# Altium project SolarPanelZPlus.PrjPcb
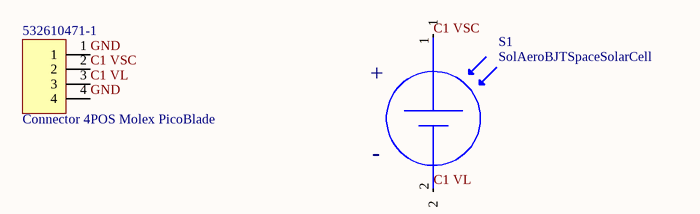
[diagram p0: SolarPanelZPlus.SchDoc]
1 sheet, 2 parts. Net scope: global (net labels, ports and power ports of the same name join across sheets).
Board file: SolarpanelZPlus.PcbDoc

## Sheet SolarPanelZPlus.SchDoc
size A

### Parts
532610471-1  Connector 4POS Molex PicoBlade  [532610471]
S1  SolAeroBJTSpaceSolarCell

### Nets
C1 VL: 532610471-1.3 S1.2
C1 VSC: 532610471-1.2 S1.1
GND: 532610471-1.1 532610471-1.4

### Notes on the sheet
- (in symbol SolAeroBJTSpaceSolarCell) +; -

### Library data of the parts
532610471-1 = 532610471